# Altium schematic sheet 2_classyTKL_matrix.SchDoc
size A2
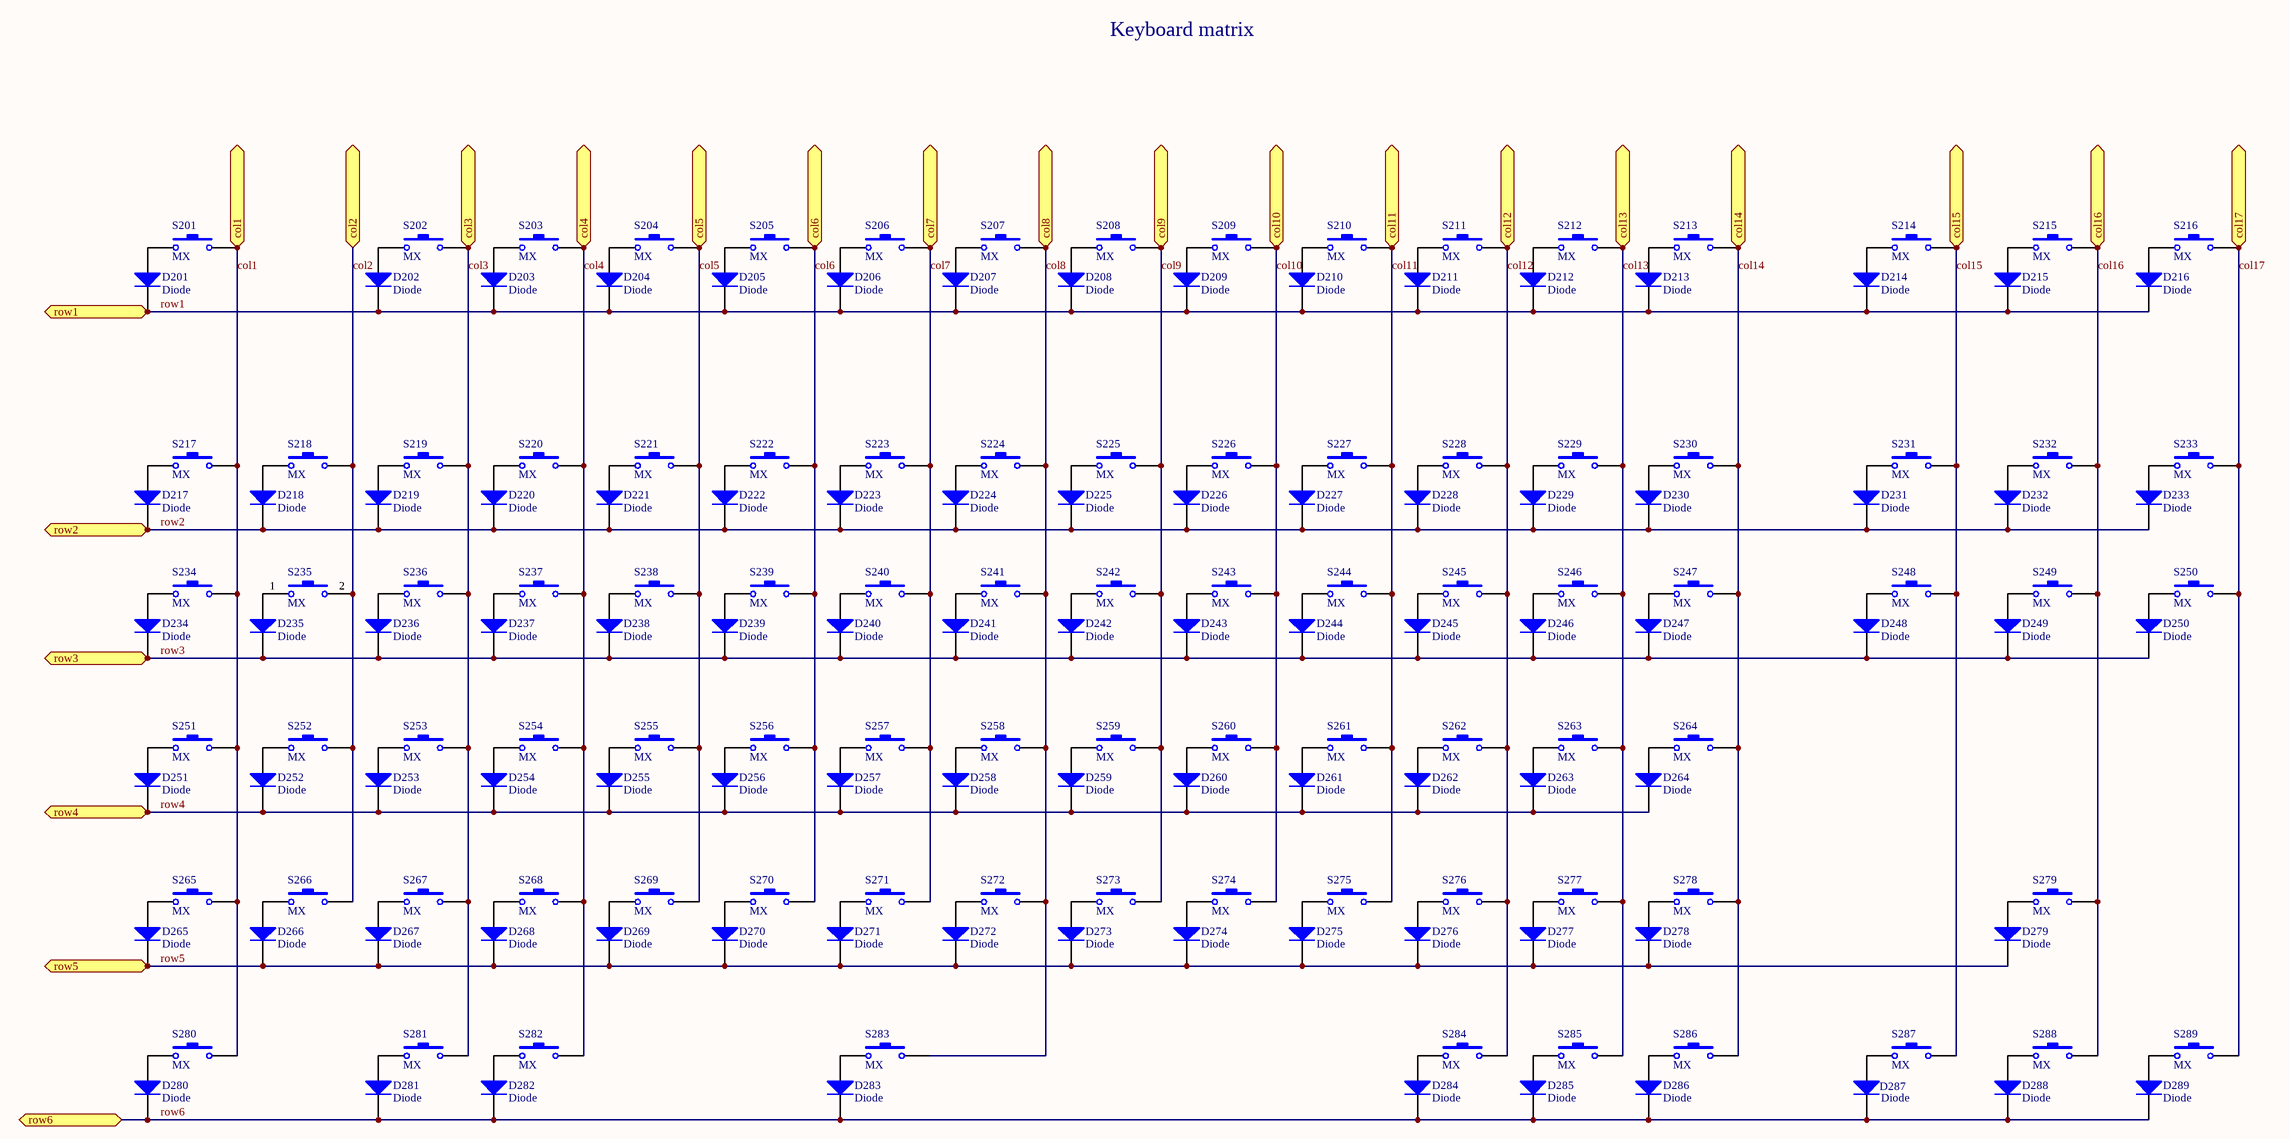
[diagram p0: 2_classyTKL_matrix.SchDoc]

## Parts
D201  Diode  [D0603[1608]]
D202  Diode  [D0603[1608]]
D203  Diode  [D0603[1608]]
D204  Diode  [D0603[1608]]
D205  Diode  [D0603[1608]]
D206  Diode  [D0603[1608]]
D207  Diode  [D0603[1608]]
D208  Diode  [D0603[1608]]
D209  Diode  [D0603[1608]]
D210  Diode  [D0603[1608]]
D211  Diode  [D0603[1608]]
D212  Diode  [D0603[1608]]
D213  Diode  [D0603[1608]]
D214  Diode  [D0603[1608]]
D215  Diode  [D0603[1608]]
D216  Diode  [D0603[1608]]
D217  Diode  [D0603[1608]]
D218  Diode  [D0603[1608]]
D219  Diode  [D0603[1608]]
D220  Diode  [D0603[1608]]
D221  Diode  [D0603[1608]]
D222  Diode  [D0603[1608]]
D223  Diode  [D0603[1608]]
D224  Diode  [D0603[1608]]
D225  Diode  [D0603[1608]]
D226  Diode  [D0603[1608]]
D227  Diode  [D0603[1608]]
D228  Diode  [D0603[1608]]
D229  Diode  [D0603[1608]]
D230  Diode  [D0603[1608]]
D231  Diode  [D0603[1608]]
D232  Diode  [D0603[1608]]
D233  Diode  [D0603[1608]]
D234  Diode  [D0603[1608]]
D235  Diode  [D0603[1608]]
D236  Diode  [D0603[1608]]
D237  Diode  [D0603[1608]]
D238  Diode  [D0603[1608]]
D239  Diode  [D0603[1608]]
D240  Diode  [D0603[1608]]
D241  Diode  [D0603[1608]]
D242  Diode  [D0603[1608]]
D243  Diode  [D0603[1608]]
D244  Diode  [D0603[1608]]
D245  Diode  [D0603[1608]]
D246  Diode  [D0603[1608]]
D247  Diode  [D0603[1608]]
D248  Diode  [D0603[1608]]
D249  Diode  [D0603[1608]]
D250  Diode  [D0603[1608]]
D251  Diode  [D0603[1608]]
D252  Diode  [D0603[1608]]
D253  Diode  [D0603[1608]]
D254  Diode  [D0603[1608]]
D255  Diode  [D0603[1608]]
D256  Diode  [D0603[1608]]
D257  Diode  [D0603[1608]]
D258  Diode  [D0603[1608]]
D259  Diode  [D0603[1608]]
D260  Diode  [D0603[1608]]
D261  Diode  [D0603[1608]]
D262  Diode  [D0603[1608]]
D263  Diode  [D0603[1608]]
D264  Diode  [D0603[1608]]
D265  Diode  [D0603[1608]]
D266  Diode  [D0603[1608]]
D267  Diode  [D0603[1608]]
D268  Diode  [D0603[1608]]
D269  Diode  [D0603[1608]]
D270  Diode  [D0603[1608]]
D271  Diode  [D0603[1608]]
D272  Diode  [D0603[1608]]
D273  Diode  [D0603[1608]]
D274  Diode  [D0603[1608]]
D275  Diode  [D0603[1608]]
D276  Diode  [D0603[1608]]
D277  Diode  [D0603[1608]]
D278  Diode  [D0603[1608]]
D279  Diode  [D0603[1608]]
D280  Diode  [D0603[1608]]
D281  Diode  [D0603[1608]]
D282  Diode  [D0603[1608]]
D283  Diode  [D0603[1608]]
D284  Diode  [D0603[1608]]
D285  Diode  [D0603[1608]]
D286  Diode  [D0603[1608]]
D287  Diode  [D0603[1608]]
D288  Diode  [D0603[1608]]
D289  Diode  [D0603[1608]]
S201  MX  [MX-switch - switched pol]  (no BOM)
S202  MX  [MX-switch]  (no BOM)
S203  MX  [MX-switch]  (no BOM)
S204  MX  [MX-switch]  (no BOM)
S205  MX  [MX-switch]  (no BOM)
S206  MX  [MX-switch]  (no BOM)
S207  MX  [MX-switch]  (no BOM)
S208  MX  [MX-switch]  (no BOM)
S209  MX  [MX-switch]  (no BOM)
S210  MX  [MX-switch]  (no BOM)
S211  MX  [MX-switch]  (no BOM)
S212  MX  [MX-switch]  (no BOM)
S213  MX  [MX-switch]  (no BOM)
S214  MX  [MX-switch]  (no BOM)
S215  MX  [MX-switch]  (no BOM)
S216  MX  [MX-switch]  (no BOM)
S217  MX  [MX-switch - switched pol]  (no BOM)
S218  MX  [MX-switch - switched pol]  (no BOM)
S219  MX  [MX-switch - switched pol]  (no BOM)
S220  MX  [MX-switch - switched pol]  (no BOM)
S221  MX  [MX-switch - switched pol]  (no BOM)
S222  MX  [MX-switch - switched pol]  (no BOM)
S223  MX  [MX-switch - switched pol]  (no BOM)
S224  MX  [MX-switch - switched pol]  (no BOM)
S225  MX  [MX-switch - switched pol]  (no BOM)
S226  MX  [MX-switch - switched pol]  (no BOM)
S227  MX  [MX-switch - switched pol]  (no BOM)
S228  MX  [MX-switch - switched pol]  (no BOM)
S229  MX  [MX-switch - switched pol]  (no BOM)
S230  MX  [MX-switch]  (no BOM)
S231  MX  [MX-switch]  (no BOM)
S232  MX  [MX-switch]  (no BOM)
S233  MX  [MX-switch]  (no BOM)
S234  MX  [MX-switch - 1.5U - switched pol]  (no BOM)
S235  MX  [MX-switch - switched pol]  (no BOM)
S236  MX  [MX-switch - switched pol]  (no BOM)
S237  MX  [MX-switch - switched pol]  (no BOM)
S238  MX  [MX-switch - switched pol]  (no BOM)
S239  MX  [MX-switch - switched pol]  (no BOM)
S240  MX  [MX-switch - switched pol]  (no BOM)
S241  MX  [MX-switch - switched pol]  (no BOM)
S242  MX  [MX-switch - switched pol]  (no BOM)
S243  MX  [MX-switch - switched pol]  (no BOM)
S244  MX  [MX-switch - switched pol]  (no BOM)
S245  MX  [MX-switch - switched pol]  (no BOM)
S246  MX  [MX-switch - switched pol]  (no BOM)
S247  MX  [MX-switch - PIPE_ISO_ENTER]  (no BOM)
S248  MX  [MX-switch]  (no BOM)
S249  MX  [MX-switch]  (no BOM)
S250  MX  [MX-switch]  (no BOM)
S251  MX  [MX-switch - CAPS]  (no BOM)
S252  MX  [MX-switch - switched pol]  (no BOM)
S253  MX  [MX-switch - switched pol]  (no BOM)
S254  MX  [MX-switch - switched pol]  (no BOM)
S255  MX  [MX-switch - switched pol]  (no BOM)
S256  MX  [MX-switch - switched pol]  (no BOM)
S257  MX  [MX-switch - switched pol]  (no BOM)
S258  MX  [MX-switch - switched pol]  (no BOM)
S259  MX  [MX-switch - switched pol]  (no BOM)
S260  MX  [MX-switch - switched pol]  (no BOM)
S261  MX  [MX-switch - switched pol]  (no BOM)
S262  MX  [MX-switch - switched pol]  (no BOM)
S263  MX  [MX-switch - Enter_ANSI_ISO_KEY]  (no BOM)
S264  MX  [MX-switch - backspace]  (no BOM)
S265  MX  [MX-switch - 2.25U]  (no BOM)
S266  MX  [MX-switch - switched pol]  (no BOM)
S267  MX  [MX-switch - switched pol]  (no BOM)
S268  MX  [MX-switch - switched pol]  (no BOM)
S269  MX  [MX-switch - switched pol]  (no BOM)
S270  MX  [MX-switch - switched pol]  (no BOM)
S271  MX  [MX-switch - switched pol]  (no BOM)
S272  MX  [MX-switch - switched pol]  (no BOM)
S273  MX  [MX-switch - switched pol]  (no BOM)
S274  MX  [MX-switch - switched pol]  (no BOM)
S275  MX  [MX-switch - switched pol]  (no BOM)
S276  MX  [MX-switch - switched pol]  (no BOM)
S277  MX  [MX-switch - right shift]  (no BOM)
S278  MX  [MX-switch - switched pol]  (no BOM)
S279  MX  [MX-switch]  (no BOM)
S280  MX  [MX-switch - 1.5U - switched pol]  (no BOM)
S281  MX  [MX-switch]  (no BOM)
S282  MX  [MX-switch - 1.5U]  (no BOM)
S283  MX  [MX-switch - 7u space]  (no BOM)
S284  MX  [MX-switch - 1.5U]  (no BOM)
S285  MX  [MX-switch]  (no BOM)
S286  MX  [MX-switch - 1.5U]  (no BOM)
S287  MX  [MX-switch]  (no BOM)
S288  MX  [MX-switch]  (no BOM)
S289  MX  [MX-switch]  (no BOM)

## Ports
col1, col2, col3, col4, col5, col6, col7, col8, col9, col10, col11, col12, col13, col14, col15, col16, col17, row1, row2, row3, row4, row5, row6

## Nets
col1: S201.2 S217.2 S234.2 S251.2 S265.2 S280.2 ; port col1
col2: S218.2 S235.2 S252.2 S266.2 ; port col2
col3: S202.2 S219.2 S236.2 S253.2 S267.2 S281.2 ; port col3
col4: S203.2 S220.2 S237.2 S254.2 S268.2 S282.2 ; port col4
col5: S204.2 S221.2 S238.2 S255.2 S269.2 ; port col5
col6: S205.2 S222.2 S239.2 S256.2 S270.2 ; port col6
col7: S206.2 S223.2 S240.2 S257.2 S271.2 ; port col7
col8: S207.2 S224.2 S241.2 S258.2 S272.2 S283.2 ; port col8
col9: S208.2 S225.2 S242.2 S259.2 S273.2 ; port col9
col10: S209.2 S226.2 S243.2 S260.2 S274.2 ; port col10
col11: S210.2 S227.2 S244.2 S261.2 S275.2 ; port col11
col12: S211.2 S228.2 S245.2 S262.2 S276.2 S284.2 ; port col12
col13: S212.2 S229.2 S246.2 S263.2 S277.2 S285.2 ; port col13
col14: S213.2 S230.2 S247.2 S264.2 S278.2 S286.2 ; port col14
col15: S214.2 S231.2 S248.2 S287.2 ; port col15
col16: S215.2 S232.2 S249.2 S279.2 S288.2 ; port col16
col17: S216.2 S233.2 S250.2 S289.2 ; port col17
row1: D201.2(K) D202.2(K) D203.2(K) D204.2(K) D205.2(K) D206.2(K) D207.2(K) D208.2(K) D209.2(K) D210.2(K) D211.2(K) D212.2(K) D213.2(K) D214.2(K) D215.2(K) D216.2(K) ; port row1
row2: D217.2(K) D218.2(K) D219.2(K) D220.2(K) D221.2(K) D222.2(K) D223.2(K) D224.2(K) D225.2(K) D226.2(K) D227.2(K) D228.2(K) D229.2(K) D230.2(K) D231.2(K) D232.2(K) D233.2(K) ; port row2
row3: D234.2(K) D235.2(K) D236.2(K) D237.2(K) D238.2(K) D239.2(K) D240.2(K) D241.2(K) D242.2(K) D243.2(K) D244.2(K) D245.2(K) D246.2(K) D247.2(K) D248.2(K) D249.2(K) D250.2(K) ; port row3
row4: D251.2(K) D252.2(K) D253.2(K) D254.2(K) D255.2(K) D256.2(K) D257.2(K) D258.2(K) D259.2(K) D260.2(K) D261.2(K) D262.2(K) D263.2(K) D264.2(K) ; port row4
row5: D265.2(K) D266.2(K) D267.2(K) D268.2(K) D269.2(K) D270.2(K) D271.2(K) D272.2(K) D273.2(K) D274.2(K) D275.2(K) D276.2(K) D277.2(K) D278.2(K) D279.2(K) ; port row5
row6: D280.2(K) D281.2(K) D282.2(K) D283.2(K) D284.2(K) D285.2(K) D286.2(K) D287.2(K) D288.2(K) D289.2(K) ; port row6
NetD201_1: D201.1(A) S201.1
NetD202_1: D202.1(A) S202.1
NetD203_1: D203.1(A) S203.1
NetD204_1: D204.1(A) S204.1
NetD205_1: D205.1(A) S205.1
NetD206_1: D206.1(A) S206.1
NetD207_1: D207.1(A) S207.1
NetD208_1: D208.1(A) S208.1
NetD209_1: D209.1(A) S209.1
NetD210_1: D210.1(A) S210.1
NetD211_1: D211.1(A) S211.1
NetD212_1: D212.1(A) S212.1
NetD213_1: D213.1(A) S213.1
NetD214_1: D214.1(A) S214.1
NetD215_1: D215.1(A) S215.1
NetD216_1: D216.1(A) S216.1
NetD217_1: D217.1(A) S217.1
NetD218_1: D218.1(A) S218.1
NetD219_1: D219.1(A) S219.1
NetD220_1: D220.1(A) S220.1
NetD221_1: D221.1(A) S221.1
NetD222_1: D222.1(A) S222.1
NetD223_1: D223.1(A) S223.1
NetD224_1: D224.1(A) S224.1
NetD225_1: D225.1(A) S225.1
NetD226_1: D226.1(A) S226.1
NetD227_1: D227.1(A) S227.1
NetD228_1: D228.1(A) S228.1
NetD229_1: D229.1(A) S229.1
NetD230_1: D230.1(A) S230.1
NetD231_1: D231.1(A) S231.1
NetD232_1: D232.1(A) S232.1
NetD233_1: D233.1(A) S233.1
NetD234_1: D234.1(A) S234.1
NetD235_1: D235.1(A) S235.1
NetD236_1: D236.1(A) S236.1
NetD237_1: D237.1(A) S237.1
NetD238_1: D238.1(A) S238.1
NetD239_1: D239.1(A) S239.1
NetD240_1: D240.1(A) S240.1
NetD241_1: D241.1(A) S241.1
NetD242_1: D242.1(A) S242.1
NetD243_1: D243.1(A) S243.1
NetD244_1: D244.1(A) S244.1
NetD245_1: D245.1(A) S245.1
NetD246_1: D246.1(A) S246.1
NetD247_1: D247.1(A) S247.1
NetD248_1: D248.1(A) S248.1
NetD249_1: D249.1(A) S249.1
NetD250_1: D250.1(A) S250.1
NetD251_1: D251.1(A) S251.1
NetD252_1: D252.1(A) S252.1
NetD253_1: D253.1(A) S253.1
NetD254_1: D254.1(A) S254.1
NetD255_1: D255.1(A) S255.1
NetD256_1: D256.1(A) S256.1
NetD257_1: D257.1(A) S257.1
NetD258_1: D258.1(A) S258.1
NetD259_1: D259.1(A) S259.1
NetD260_1: D260.1(A) S260.1
NetD261_1: D261.1(A) S261.1
NetD262_1: D262.1(A) S262.1
NetD263_1: D263.1(A) S263.1
NetD264_1: D264.1(A) S264.1
NetD265_1: D265.1(A) S265.1
NetD266_1: D266.1(A) S266.1
NetD267_1: D267.1(A) S267.1
NetD268_1: D268.1(A) S268.1
NetD269_1: D269.1(A) S269.1
NetD270_1: D270.1(A) S270.1
NetD271_1: D271.1(A) S271.1
NetD272_1: D272.1(A) S272.1
NetD273_1: D273.1(A) S273.1
NetD274_1: D274.1(A) S274.1
NetD275_1: D275.1(A) S275.1
NetD276_1: D276.1(A) S276.1
NetD277_1: D277.1(A) S277.1
NetD278_1: D278.1(A) S278.1
NetD279_1: D279.1(A) S279.1
NetD280_1: D280.1(A) S280.1
NetD281_1: D281.1(A) S281.1
NetD282_1: D282.1(A) S282.1
NetD283_1: D283.1(A) S283.1
NetD284_1: D284.1(A) S284.1
NetD285_1: D285.1(A) S285.1
NetD286_1: D286.1(A) S286.1
NetD287_1: D287.1(A) S287.1
NetD288_1: D288.1(A) S288.1
NetD289_1: D289.1(A) S289.1

## Notes on the sheet
- Keyboard matrix

## Library data of the parts
D201-D289 = Diode: Default Diode; MRF.Part: CD4148WTP; MFG: Bourns Inc.; MFGPN: CD0603-B0340R; LCSC MFG: Brightking Elec (TAIWAN); Version: 0603 imperial; LCSC Part #: C109002
S201-S233 S235-S289 = SW-PB: Switch
S234 = SW-PB: TAB